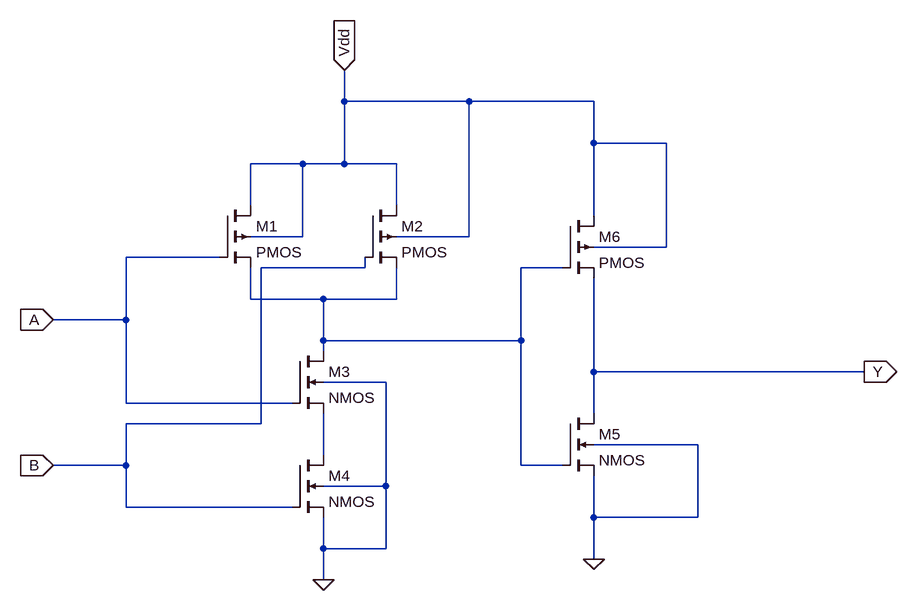
[diagram p0: schematic AND.asc]
AND.asc, the LTspice schematic file:
Version 4
SHEET 1 1100 680
WIRE 224 -112 224 -160
WIRE 416 -112 224 -112
WIRE 608 -112 416 -112
WIRE 608 -48 608 -112
WIRE 720 -48 608 -48
WIRE 160 -16 80 -16
WIRE 224 -16 224 -112
WIRE 224 -16 160 -16
WIRE 304 -16 224 -16
WIRE 80 48 80 -16
WIRE 304 48 304 -16
WIRE 608 64 608 -48
WIRE 160 96 160 -16
WIRE 160 96 80 96
WIRE 416 96 416 -112
WIRE 416 96 304 96
WIRE 720 112 720 -48
WIRE 720 112 608 112
WIRE 32 128 -112 128
WIRE 256 144 256 128
WIRE 256 144 96 144
WIRE 560 144 496 144
WIRE 80 192 80 144
WIRE 192 192 80 192
WIRE 304 192 304 144
WIRE 304 192 192 192
WIRE -112 224 -112 128
WIRE -112 224 -224 224
WIRE 192 256 192 192
WIRE 496 256 496 144
WIRE 496 256 192 256
WIRE 192 272 192 256
WIRE 608 304 608 160
WIRE 1024 304 608 304
WIRE 288 320 192 320
WIRE -112 352 -112 224
WIRE 144 352 -112 352
WIRE 608 368 608 304
WIRE 96 384 96 144
WIRE 96 384 -112 384
WIRE 768 416 608 416
WIRE 192 432 192 368
WIRE -112 448 -112 384
WIRE -112 448 -224 448
WIRE 496 448 496 256
WIRE 560 448 496 448
WIRE 288 480 288 320
WIRE 288 480 192 480
WIRE -112 512 -112 448
WIRE 144 512 -112 512
WIRE 608 528 608 464
WIRE 768 528 768 416
WIRE 768 528 608 528
WIRE 192 576 192 528
WIRE 288 576 288 480
WIRE 288 576 192 576
WIRE 608 592 608 528
WIRE 192 624 192 576
FLAG 192 624 0
FLAG -224 224 A
IOPIN -224 224 In
FLAG -224 448 B
IOPIN -224 448 In
FLAG 224 -160 Vdd
IOPIN 224 -160 In
FLAG 608 592 0
FLAG 1024 304 Y
IOPIN 1024 304 Out
SYMBOL pmos4 32 48 R0
SYMATTR InstName M1
SYMBOL nmos4 144 272 R0
SYMATTR InstName M3
SYMBOL nmos4 144 432 R0
SYMATTR InstName M4
SYMBOL nmos4 560 368 R0
SYMATTR InstName M5
SYMBOL pmos4 560 64 R0
SYMATTR InstName M6
SYMBOL pmos4 256 48 R0
SYMATTR InstName M2

The netlist it stands for:
* AND.asc
M1 Vdd A N001 Vdd PMOS
M3 N001 A N002 0 NMOS
M4 N002 B 0 0 NMOS
M5 Y N001 0 0 NMOS
M6 Vdd N001 Y Vdd PMOS
M2 Vdd B N001 Vdd PMOS
.model NMOS NMOS
.model PMOS PMOS
.lib standard.mos
.backanno
.end